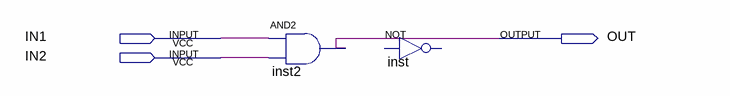
[diagram p0: schematic sheet]
// Quartus schematic Block1.bdf as structural Verilog: 2 symbols, 3 pins
module Block1 (
  input  IN1,
  input  IN2,
  output OUT
);

  and inst2 (OUT, IN1, IN2);
  // NOT inst is placed but not wired
endmodule
